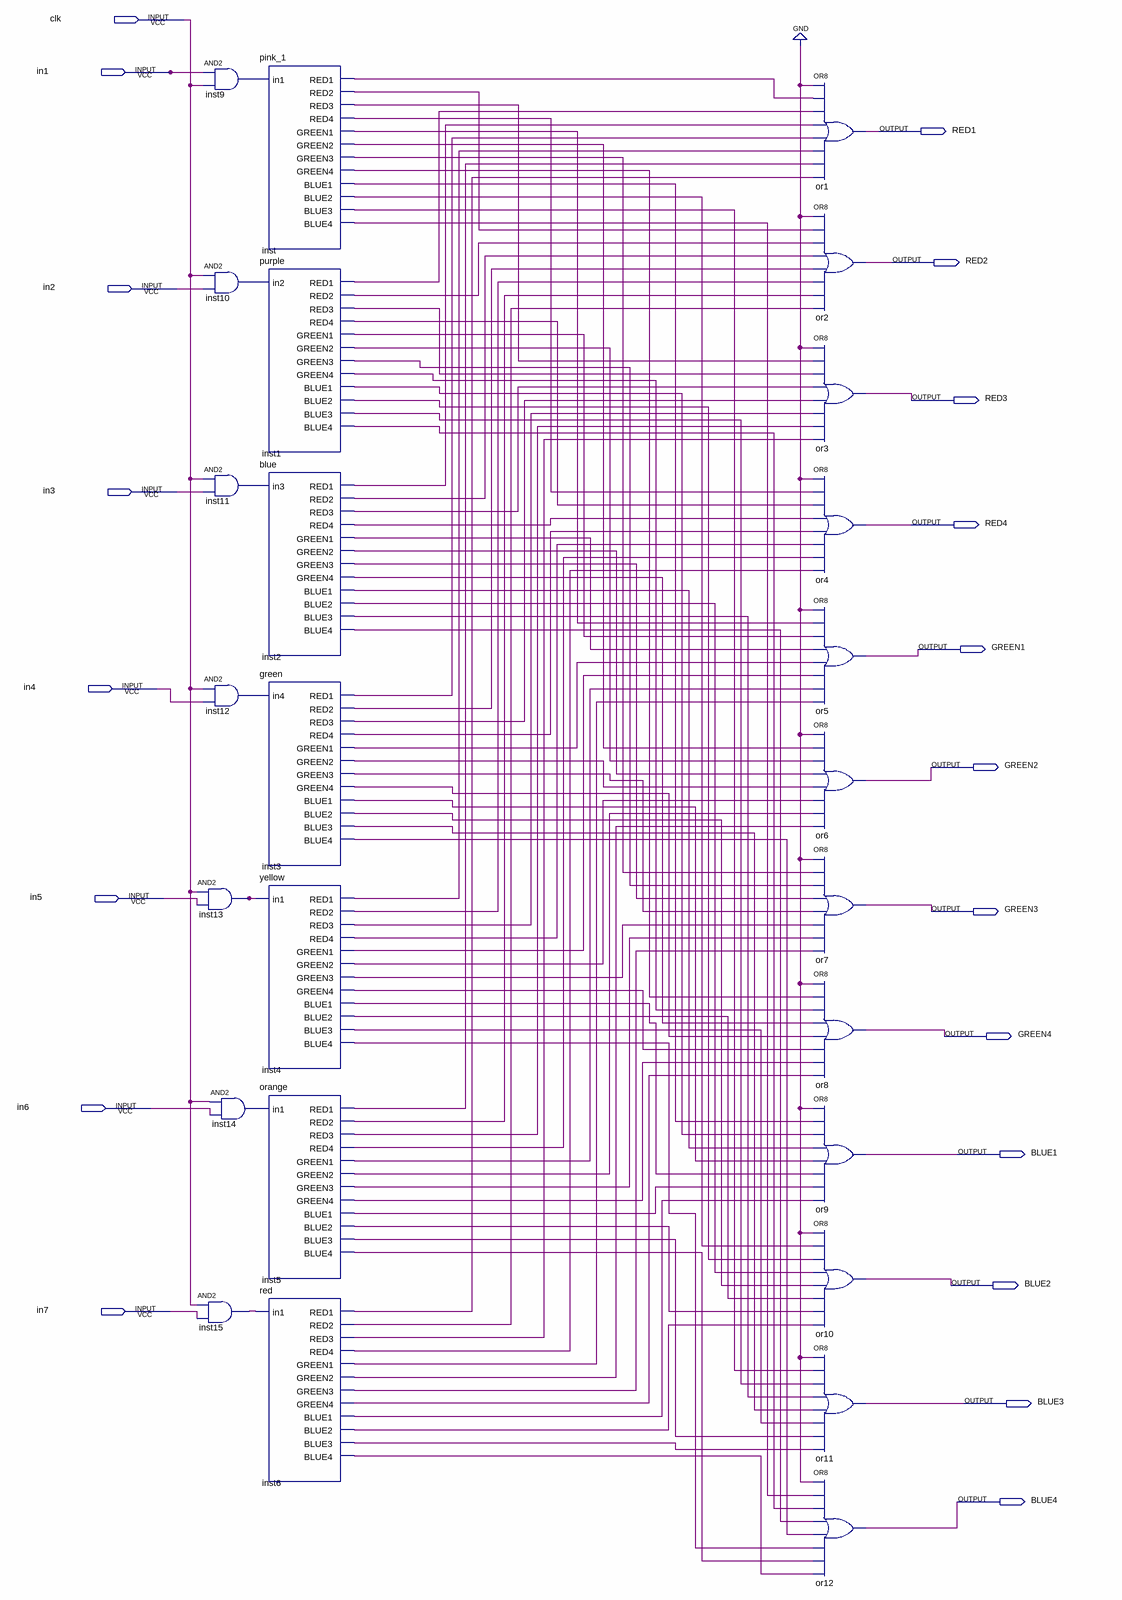
[diagram p0: schematic sheet]
// Quartus schematic Led.bdf as structural Verilog: 26 symbols, 20 pins
module Led (
  input  clk,
  input  in1,
  input  in2,
  input  in3,
  input  in4,
  input  in5,
  input  in6,
  input  in7,
  output RED1,
  output RED2,
  output RED3,
  output RED4,
  output GREEN1,
  output GREEN2,
  output GREEN3,
  output GREEN4,
  output BLUE1,
  output BLUE2,
  output BLUE3,
  output BLUE4
);

  wire inst1_blue1, inst1_blue2, inst1_blue3, inst1_blue4, inst1_green1, inst1_green2, inst1_green3,
       inst1_green4, inst1_red1, inst1_red2, inst1_red3, inst1_red4, inst2_blue1, inst2_blue2, inst2_blue3,
       inst2_blue4, inst2_green1, inst2_green2, inst2_green3, inst2_green4, inst2_red1, inst2_red2,
       inst2_red3, inst2_red4, inst3_blue1, inst3_blue2, inst3_blue3, inst3_blue4, inst3_green1,
       inst3_green2, inst3_green3, inst3_green4, inst3_red1, inst3_red2, inst3_red3, inst3_red4, inst4_blue1,
       inst4_blue2, inst4_blue3, inst4_blue4, inst4_green1, inst4_green2, inst4_green3, inst4_green4,
       inst4_red1, inst4_red2, inst4_red3, inst4_red4, inst5_blue1, inst5_blue2, inst5_blue3, inst5_blue4,
       inst5_green1, inst5_green2, inst5_green3, inst5_green4, inst5_red1, inst5_red2, inst5_red3,
       inst5_red4, inst6_blue1, inst6_blue2, inst6_blue3, inst6_blue4, inst6_green1, inst6_green2,
       inst6_green3, inst6_green4, inst6_red1, inst6_red2, inst6_red3, inst6_red4, inst9_out, inst10_out,
       inst11_out, inst12_out, inst13_out, inst14_out, inst15_out, inst_blue1, inst_blue2, inst_blue3,
       inst_blue4, inst_green1, inst_green2, inst_green3, inst_green4, inst_red1, inst_red2, inst_red3,
       inst_red4;

  and inst9 (inst9_out, in1, clk);
  and inst10 (inst10_out, clk, in2);
  and inst11 (inst11_out, clk, in3);
  and inst12 (inst12_out, clk, in4);
  and inst13 (inst13_out, clk, in5);
  and inst14 (inst14_out, clk, in6);
  and inst15 (inst15_out, clk, in7);
  pink_1 inst (
    .in1(inst9_out), .RED1(inst_red1), .RED2(inst_red2), .RED3(inst_red3), .RED4(inst_red4),
    .GREEN1(inst_green1), .GREEN2(inst_green2), .GREEN3(inst_green3), .GREEN4(inst_green4),
    .BLUE1(inst_blue1), .BLUE2(inst_blue2), .BLUE3(inst_blue3), .BLUE4(inst_blue4));
  purple inst1 (
    .in2(inst10_out), .RED1(inst1_red1), .RED2(inst1_red2), .RED3(inst1_red3), .RED4(inst1_red4),
    .GREEN1(inst1_green1), .GREEN2(inst1_green2), .GREEN3(inst1_green3), .GREEN4(inst1_green4),
    .BLUE1(inst1_blue1), .BLUE2(inst1_blue2), .BLUE3(inst1_blue3), .BLUE4(inst1_blue4));
  blue inst2 (
    .in3(inst11_out), .RED1(inst2_red1), .RED2(inst2_red2), .RED3(inst2_red3), .RED4(inst2_red4),
    .GREEN1(inst2_green1), .GREEN2(inst2_green2), .GREEN3(inst2_green3), .GREEN4(inst2_green4),
    .BLUE1(inst2_blue1), .BLUE2(inst2_blue2), .BLUE3(inst2_blue3), .BLUE4(inst2_blue4));
  green inst3 (
    .in4(inst12_out), .RED1(inst3_red1), .RED2(inst3_red2), .RED3(inst3_red3), .RED4(inst3_red4),
    .GREEN1(inst3_green1), .GREEN2(inst3_green2), .GREEN3(inst3_green3), .GREEN4(inst3_green4),
    .BLUE1(inst3_blue1), .BLUE2(inst3_blue2), .BLUE3(inst3_blue3), .BLUE4(inst3_blue4));
  yellow inst4 (
    .in1(inst13_out), .RED1(inst4_red1), .RED2(inst4_red2), .RED3(inst4_red3), .RED4(inst4_red4),
    .GREEN1(inst4_green1), .GREEN2(inst4_green2), .GREEN3(inst4_green3), .GREEN4(inst4_green4),
    .BLUE1(inst4_blue1), .BLUE2(inst4_blue2), .BLUE3(inst4_blue3), .BLUE4(inst4_blue4));
  orange inst5 (
    .in1(inst14_out), .RED1(inst5_red1), .RED2(inst5_red2), .RED3(inst5_red3), .RED4(inst5_red4),
    .GREEN1(inst5_green1), .GREEN2(inst5_green2), .GREEN3(inst5_green3), .GREEN4(inst5_green4),
    .BLUE1(inst5_blue1), .BLUE2(inst5_blue2), .BLUE3(inst5_blue3), .BLUE4(inst5_blue4));
  red inst6 (
    .in1(inst15_out), .RED1(inst6_red1), .RED2(inst6_red2), .RED3(inst6_red3), .RED4(inst6_red4),
    .GREEN1(inst6_green1), .GREEN2(inst6_green2), .GREEN3(inst6_green3), .GREEN4(inst6_green4),
    .BLUE1(inst6_blue1), .BLUE2(inst6_blue2), .BLUE3(inst6_blue3), .BLUE4(inst6_blue4));
  or or1 (RED1, 1'b0, inst_red1, inst1_red1, inst2_red1, inst3_red1, inst4_red1, inst5_red1, inst6_red1);
  or or2 (RED2, 1'b0, inst_red2, inst1_red2, inst2_red2, inst3_red2, inst4_red2, inst5_red2, inst6_red2);
  or or3 (RED3, 1'b0, inst_red3, inst1_red3, inst2_red3, inst3_red3, inst4_red3, inst5_red3, inst6_red3);
  or or4 (RED4, 1'b0, inst_red4, inst1_red4, inst2_red4, inst3_red4, inst4_red4, inst5_red4, inst6_red4);
  or or5 (GREEN1, 1'b0, inst_green1, inst1_green1, inst2_green1, inst3_green1, inst4_green1, inst5_green1, inst6_green1);
  or or6 (GREEN2, 1'b0, inst_green2, inst1_green2, inst2_green2, inst3_green2, inst4_green2, inst5_green2, inst6_green2);
  or or7 (GREEN3, 1'b0, inst_green3, inst1_green3, inst2_green3, inst3_green3, inst4_green3, inst5_green3, inst6_green3);
  or or8 (GREEN4, 1'b0, inst_green4, inst1_green4, inst2_green4, inst3_green4, inst4_green4, inst5_green4, inst6_green4);
  or or9 (BLUE1, 1'b0, inst_blue1, inst1_blue1, inst2_blue1, inst3_blue1, inst4_blue1, inst5_blue1, inst6_blue1);
  or or10 (BLUE2, 1'b0, inst_blue2, inst1_blue2, inst2_blue2, inst3_blue2, inst4_blue2, inst5_blue2, inst6_blue2);
  or or11 (BLUE3, 1'b0, inst_blue3, inst1_blue3, inst2_blue3, inst3_blue3, inst4_blue3, inst5_blue3, inst6_blue3);
  or or12 (BLUE4, 1'b0, inst_blue4, inst1_blue4, inst2_blue4, inst3_blue4, inst4_blue4, inst5_blue4, inst6_blue4);
endmodule
